# Altium schematic sheet Enerfi.SchDoc: Enerfi
size A4; Author: Juan Manuel Deseta, Juan Ignacio Figueiras, Nicolas Mahnic, Tiago Monteiro, Eric Ortiz; CompanyName: Proyecto FInal; Engineer: Ing. Tapino; Tutor: Ing. Gutnei, Ing. Hampel
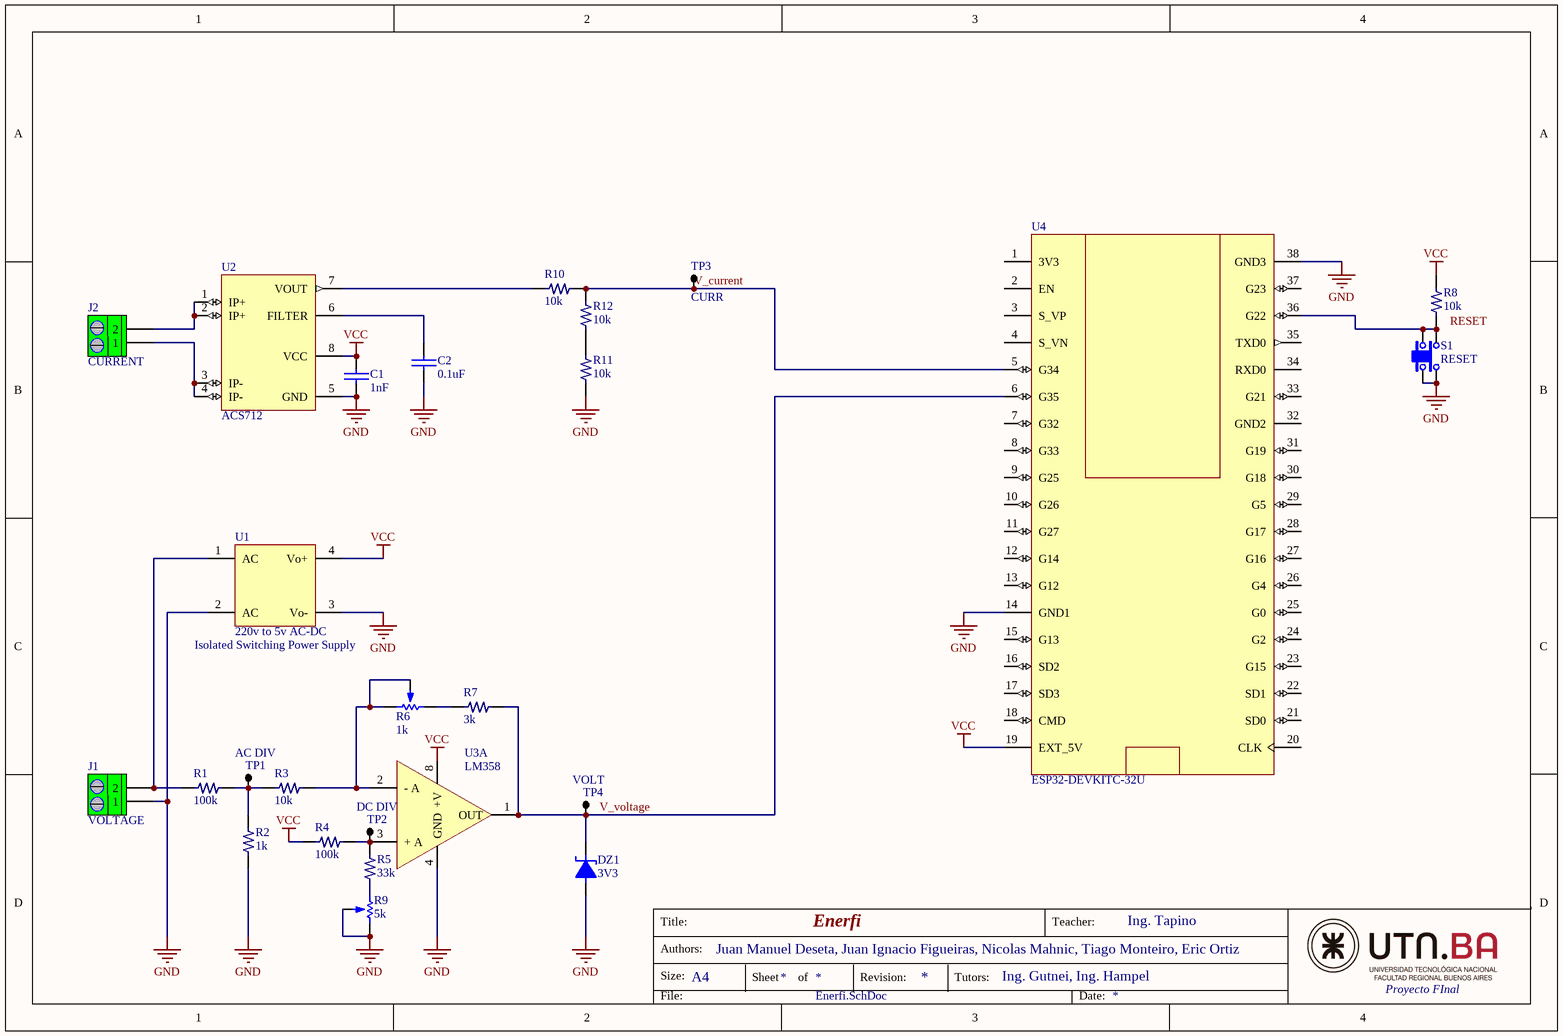
[diagram p0: Enerfi.SchDoc]

## Parts
C1  1nF  [C0805-0.80]
C2  0.1uF  [C0805-0.80]
DZ1  3V3  [DO35]
J1  VOLTAGE  [BORNERA2]
J2  CURRENT  [BORNERA2]
R1  100k  [R0805-0.45]
R2  1k  [R0805-0.45]
R3  10k  [R0805-0.45]
R4  100k  [R0805-0.45]
R5  33k  [R0805-0.45]
R6  1k  [PRESET V]
R7  3k  [R0805-0.45]
R8  10k  [R0805-0.45]
R9  5k  [PRESET V]
R10  10k  [R0805-0.45]
R11  10k  [R0805-0.45]
R12  10k  [R0805-0.45]
S1  RESET  [TACTSWITCH]
TP1  AC DIV  [TPTH]
TP2  DC DIV  [TPTH]
TP3  CURR  [TPTH]
TP4  VOLT  [TPTH]
U1  220v to 5v AC-DC  [HLK PM01]
U2  ACS712  [SOP127P600X175-8N]
U3  LM358  [SOP127P600X175-8N]  (part A of 2)
U4  ESP32-DEVKITC-32U  [MODULE_ESP32_DEVKIT_V1]

## Nets
GND: C1.2 C2.2 DZ1.1 J1.1 R2.1 R9.1 R9.2 R11.1 S1.1 S1.2 U1.2(AC) U1.3(Vo-) U2.5(GND) U3.4(GND) U4.14(GND1) U4.38(GND3)
VCC: C1.1 R4.1 R8.2 U1.4(Vo+) U2.8(VCC) U3.8(+V) U4.19(EXT_5V)
V_current: R10.2 R12.2 TP3.1 U4.5(G34)
V_voltage: DZ1.2 R7.2 TP4.1 U3.1(OUT) U4.6(G35)
NetC2_1: C2.1 U2.6(FILTER)
NetJ1_2: J1.2 R1.1 U1.1(AC)
NetJ2_1: J2.1 U2.3(IP-) U2.4(IP-)
NetJ2_2: J2.2 U2.1(IP+) U2.2(IP+)
NetR1_2: R1.2 R2.2 R3.1 TP1.1
NetR3_2: R3.2 R6.1 R6.2 U3.2(-_A)
NetR4_2: R4.2 R5.2 TP2.1 U3.3(+_A)
NetR5_1: R5.1 R9.3
NetR6_3: R6.3 R7.1
NetR8_1: R8.1 S1.3 S1.4 U4.36(G22)
NetR10_1: R10.1 U2.7(VOUT)
NetR11_2: R11.2 R12.1

Not connected (* = marked no-connect by the designer): U4 1(3V3) 2(EN) 3(S_VP) 4(S_VN) 7(G32) 8(G33) 9(G25) 10(G26) 11(G27) 12(G14) 13(G12) 15(G13) 16(SD2) 17(SD3) 18(CMD) 20(CLK) 21(SD0) 22(SD1) 23(G15) 24(G2) 25(G0) 26(G4) 27(G16) 28(G17) 29(G5) 30(G18) 31(G19) 32(GND2) 33(G21) 34(RXD0) 35(TXD0) 37(G23)

## Notes on the sheet
- Isolated Switching Power Supply
- Labels drawn without touching a wire or pin: RESET
- Title:
- Teacher:
- Size:
- Authors:
- A4
- Sheet
- of
- Revision:
- Tutors:
- File:
- Date:

## Library data of the parts
C1 C2 = CAP
DZ1 = DIODO ZENER
J1 J2 = BORNERA 2_V
R1-R5 R7 R8 R10-R12 = RES_1
R6 R9 = Preset
S1 = TACT SW
TP1-TP4 = TP
U1 = HLK PM01: HLK PM01 220v to 5v AC-DC Isolated Switching Power Supply; Autor: Nicolas Mahnic
U2 = ACS712: Hall Effect-Based Linear Current Sensor; Autor: Nicolas Mahnic; Datasheet: https://www.sparkfun.com/datasheets/BreakoutBoards/0712.pdf; Application Note: https://www.allegromicro.com/en/insights-and-innovations/technical-documents/hall-effect-sensor-ic-publications/current-sensor-ics-in-current-divider-configurations
U4 = ESP32-DEVKITC-32U: - Transceiver; 802.11 b/g/n _Wi-Fi, WiFi, WLAN_, BluetoothÂ® Smart 4.x Low Energy _BLE_ For Use With ESP-WROOM-32; MF: Espressif Systems; Autor: Nicolas Mahnic; Package: None; MP: ESP32-DEVKITC-32U